# EAGLE design Escorna_CPU_2_01 (EAGLE 6.4)
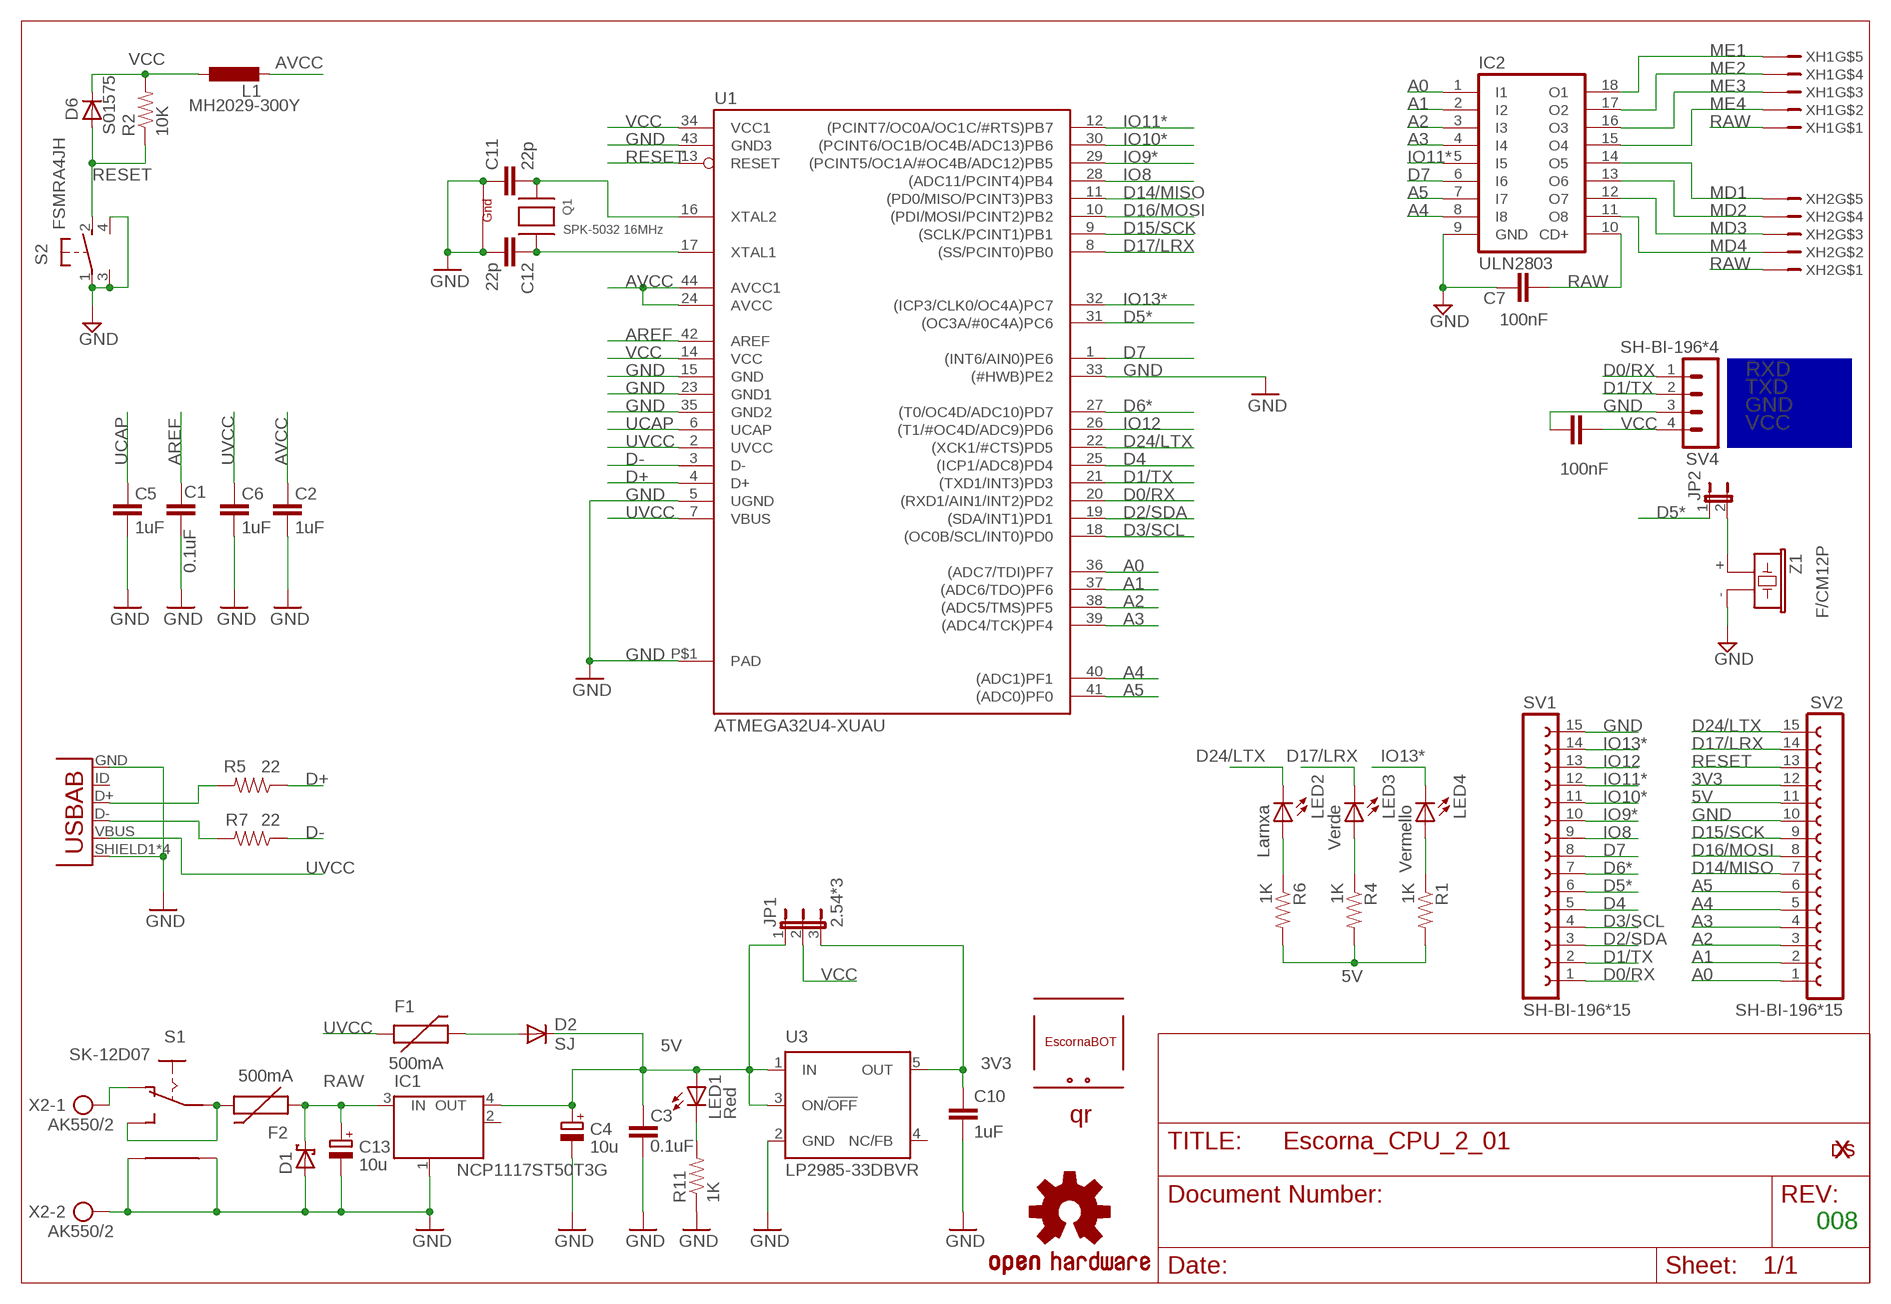
[diagram p0: schematic, sheet 1]

## Parts
C1  0.1uF  CAP0603-CAP  [0603-CAP]
C2  1uF  CAP0603-CAP  [0603-CAP]
C3  0.1uF  CAP0603-CAP  [0603-CAP]
C4  10u  CPOL-EUSMCB  [SMC_B]
C5  1uF  CAP0603-CAP  [0603-CAP]
C6  1uF  CAP0603-CAP  [0603-CAP]
C7  100nF  C-EUC0603K  [C0603K]
C8  100nF  C-EUC0603K  [C0603K]
C10  1uF  CAP0603-CAP  [0603-CAP]
C11  22p  C-EUC0603  [C0603-ROUND]
C12  22p  C-EUC0603  [C0603-ROUND]
C13  10u  CPOL-EUSMCB  [SMC_B]
D1  SCHOTTKY-DIODESMA  [SMA]
D2  SJ  DIODESOD  [SOD-323]
D6  S01575  DIODESOD  [SOD-323]
F1  500mA  PTCSMD  [PTC-1206]
F2  500mA  PTCSMD  [PTC-1206]
IC1  NCP1117ST50T3G  MC33269ST-3.3T3  [SOT223]
IC2  ULN2803  ULN2803A"  [DIL18]
JP1  2.54*3  JP2E  [JP2]
JP2  JP1E  [JP1]
L1  MH2029-300Y  L-EUL2012C  [L2012C]
LED1  Red  LED0603  [LED-0603]
LED2  Larnxa  LED0603  [LED-0603]
LED3  Verde  LED0603  [LED-0603]
LED4  Vermello  LED0603  [LED-0603]
LOGO1  OSHW-LOGOS  [OSHW-LOGO-S]
Q1  SPK-5032 16MHz  XTAL-4-3225  [NX3225]
R1  1K  RESISTOR0603-RES  [0603-RES]
R2  10K  RESISTOR0603-RES  [0603-RES]
R4  1K  RESISTOR0603-RES  [0603-RES]
R5  22  RESISTOR0603-RES  [0603-RES]
R6  1K  RESISTOR0603-RES  [0603-RES]
R7  22  RESISTOR0603-RES  [0603-RES]
R11  1K  RESISTOR0603-RES  [0603-RES]
S1  SK-12D07  SK12F14D  [SK-12D07]
S2  FSMRA4JH  31-XX  [B3F-31XX]
SV1  SH-BI-196*15  FE15-1  [FE15]
SV2  SH-BI-196*15  FE15-1  [FE15]
SV4  SH-BI-196*4  MA04-1  [MA04-1]
U1  ATMEGA32U4-XUAU  [TQFP44-PAD]
U2  MICRO USB  USB-AB  [USB-AB-MICRO-SMD]
U3  LP2985-33DBVR  LP2985-XXDBVR33  [SOT23-DBV]
U$2  XDESIG  [XDESIG_CU_2]
U$3  ESCORNABOT  [ESCORNA_PEQUE]
U$5  XDESIG21  [XDESIG]
U$6  QR25  [ESCORNA_QR25]
X2  AK550/2  [AK550/2]
XH1  XH2.54-5P  B5B-XH-A  [B5B-XH-A]
XH2  XH2.54-5P  B5B-XH-A  [B5B-XH-A]
Z1  F/CM12P  [F/CM12P]

## Nets
3V3: C10.1 JP1.3 SV2.12 U3.5(OUT)
5V: C3.2 C4.+ D2.1(C) IC1.4(OUT) JP1.1 LED1.A R1.2 R4.2 R6.2 SV2.11 U3.1(IN) U3.3(ON/!OFF)
A0: IC2.1(I1) SV2.1 U1.36((ADC7/TDI)PF7)
A1: IC2.2(I2) SV2.2 U1.37((ADC6/TDO)PF6)
A2: IC2.3(I3) SV2.3 U1.38((ADC5/TMS)PF5)
A3: IC2.4(I4) SV2.4 U1.39((ADC4/TCK)PF4)
A4: IC2.8(I8) SV2.5 U1.40((ADC1)PF1)
A5: IC2.7(I7) SV2.6 U1.41((ADC0)PF0)
AREF [aref]: C1.2 U1.42(AREF)
AVCC: C2.2 L1.2 U1.24(AVCC) U1.44(AVCC1)
D0/RX: SV1.1 SV4.1 U1.20((RXD1/AIN1/INT2)PD2)
D1/TX: SV1.2 SV4.2 U1.21((TXD1/INT3)PD3)
D2/SDA: SV1.3 U1.19((SDA/INT1)PD1)
D3/SCL: SV1.4 U1.18((OC0B/SCL/INT0)PD0)
D4: SV1.5 U1.25((ICP1/ADC8)PD4)
D5*: JP2.1 SV1.6 U1.31((OC3A/#0C4A)PC6)
D6*: SV1.7 U1.27((T0/OC4D/ADC10)PD7)
D7: IC2.6(I6) SV1.8 U1.1((INT6/AIN0)PE6)
D14/MISO: SV2.7 U1.11((PD0/MISO/PCINT3)PB3)
D15/SCK: SV2.9 U1.9((SCLK/PCINT1)PB1)
D16/MOSI: SV2.8 U1.10((PDI/MOSI/PCINT2)PB2)
D17/LRX: LED3.C SV2.14 U1.8((SS/PCINT0)PB0)
D24/LTX: LED2.C SV2.15 U1.22((XCK1/#CTS)PD5)
D+: R5.1 U1.4(D+)
D-: R7.1 U1.3(D-)
GND [power]: C1.1 C2.1 C3.1 C4.- C5.1 C6.1 C7.1 C8.1 C10.2 C11.1 C12.2 C13.- D1.A IC1.1(GND/ADJ) IC2.9(GND) Q1.2(G2) Q1.4(G1) R11.1 S1.P$4 S1.P$5 S2.1(P) S2.3(CH2) S2.4(CH1) SV1.15 SV2.10 SV4.3 U1.5(UGND) U1.15(GND) U1.23(GND1) U1.33((#HWB)PE2) U1.35(GND2) U1.43(GND3) U1.P$1(PAD) U2.GND U2.SHIELD1(SHIELD) U2.SHIELD2(SHIELD) U2.SHIELD3(SHIELD) U2.SHIELD4(SHIELD) U3.2(GND) X2.2 Z1.-
IO8: SV1.9 U1.28((ADC11/PCINT4)PB4)
IO9*: SV1.10 U1.29((PCINT5/OC1A/#OC4B/ADC12)PB5)
IO10*: SV1.11 U1.30((PCINT6/OC1B/OC4B/ADC13)PB6)
IO11*: IC2.5(I5) SV1.12 U1.12((PCINT7/OC0A/OC1C/#RTS)PB7)
IO12: SV1.13 U1.26((T1/#OC4D/ADC9)PD6)
IO13*: LED4.C SV1.14 U1.32((ICP3/CLK0/OC4A)PC7)
MD1: IC2.14(O5) XH2.P$5
MD2: IC2.13(O6) XH2.P$4
MD3: IC2.12(O7) XH2.P$3
MD4: IC2.11(O8) XH2.P$2
ME1: IC2.18(O1) XH1.P$5
ME2: IC2.17(O2) XH1.P$4
ME3: IC2.16(O3) XH1.P$3
ME4: IC2.15(O4) XH1.P$2
N$1: F2.2 S1.P$1(P) S1.P$3(S)
N$2: LED2.A R6.1
N$3: D2.2(A) F1.2
N$4: LED3.A R4.1
N$5: LED4.A R1.1
N$6: R7.2 U2.D-
N$7: S1.P$2(O) X2.1
N$8: R5.2 U2.D+
N$9: C12.1 Q1.3(X2) U1.17(XTAL1)
N$10: LED1.C R11.2
N$11: JP2.2 Z1.+
RAW: C7.2 C13.+ D1.C F2.1 IC1.3(IN) IC2.10(CD+) XH1.P$1 XH2.P$1
RESET: D6.2(A) R2.1 S2.2(S) SV2.13 U1.13(RESET)
UCAP: C5.2 U1.6(UCAP)
UVCC: C6.2 F1.1 U1.2(UVCC) U1.7(VBUS) U2.VBUS
VCC: C8.2 D6.1(C) JP1.2 L1.1 R2.2 SV4.4 U1.14(VCC) U1.34(VCC1)
XTAL3: C11.2 Q1.1(X1) U1.16(XTAL2)
Unconnected: IC1.2(OUT) U2.ID(USBID) U3.4(NC/FB)

## Notes on the sheet
- RXD
- TXD
- GND
- VCC
- 008

## Library data of the parts
C1-C3 C5 C6 C10 = SparkFun:CAP: Capacitor Standard 0603 ceramic capacitor, and 0.1" leaded capacitor.
C4 C13 = rcl:CPOL-EU: POLARIZED CAPACITOR, European symbol
C7 C8 = rcl:C-EU: CAPACITOR, European symbol
C11 C12 = SmartPrj:C-EU: CAPACITOR, European symbol
D1 = diode:SCHOTTKY-DIODE: Schottky Diode
D2 D6 = SparkFun:DIODE: Diode These are standard reverse protection diodes and small signal diodes. SMA package can handle up to about 1A. SOD-323 can handle about 200mA. What the SOD-323 package when ordering, there are some mfgs out there that are 5-pin packages.
F1 F2 = SparkFun:PTC: Resettable Fuse PTC Resettable Fuse. Spark Fun Electronics SKU : COM-08357
IC1 = linear:MC33269ST*: Adjustable Output Low Dropout Voltage Regulator 800 mA Source: http://www.onsemi.com/pub/Collateral/MC33269-D.PDF
IC2 = uln-udn:ULN2803A: DRIVER ARRAY
JP1 = jumper:JP2E: JUMPER
JP2 = jumper:JP1E: JUMPER
L1 = rcl:L-EU: INDUCTOR, European symbol
LED1-LED4 = SparkFun:LED: LEDs Standard schematic elements and footprints for 5mm, 3mm, 1206, and 0603 sized LEDs. 5mm - Spark Fun Electronics SKU : COM-00529 (and others)
LOGO1 = SparkFun-Aesthetics:OSHW-LOGO: Open Source Hardware Logo This logo indicates the piece of hardware it is found on incorporates a OSHW license and/or adheres to the definition of open source hardware found here: http://freedomdefined.org/OSHW
Q1 = adafruit:XTAL-4: Classic 4-pin 3.2 x 2.5mm crystal
R1 R2 R4-R7 R11 = SparkFun:RESISTOR: Resistor Basic schematic elements and footprints for 0603, 1206, and PTH resistors.
S1 = escorna:SK12F14
S2 = switch-omron:31-XX: OMRON SWITCH; MPN: B3F-3100; OC_FARNELL: 959704; OC_NEWARK: 36M3582
SV1 SV2 = con-lsta:FE15-1: FEMALE HEADER; OC_FARNELL: unknown; OC_NEWARK: unknown
SV4 = con-lstb:MA04-1: PIN HEADER; OC_FARNELL: unknown; OC_NEWARK: unknown
U1 = SmartPrj:ATMEGA32U4-XU
U2 = SparkFun-Connectors:USB-AB: This is a USB AB connector that is compatible with USB OTG. i.e. this connector can serve as a host or device
U3 = SmartPrj:LP2985-XXDBVR: ULTRALOW-POWER 50-mA LOW-DROPOUT LINEAR REGULATORS 50-mA Low-Dropout Regulator Source: http://focus.ti.com/lit/ds/symlink/tps77001.pdf
U$2 U$5 = xdesig:XDESIG
U$3 = escorna:ESCORNABOT
U$6 = escorna:QR
X2 = con-ptr500:AK550/2: CONNECTOR; OC_FARNELL: unknown; OC_NEWARK: unknown
XH1 XH2 = con-jst:B5B-XH-A
Z1 = buzzer:F/CM12P: BUZZER Source: Buerklin; OC_FARNELL: unknown; OC_NEWARK: unknown

## Net classes
0 default: width 0.254 mm, drill 0.61 mm, clearance 0.254 mm
1 power: width 0.254 mm, drill 0.61 mm, clearance 0.254 mm
2 gnd: width 0.254 mm, drill 0.61 mm, clearance 0.254 mm
3 usbvcc: width 0.254 mm, drill 0.61 mm, clearance 0.254 mm
4 aref: width 0.254 mm, drill 0.61 mm, clearance 0.254 mm

## Board
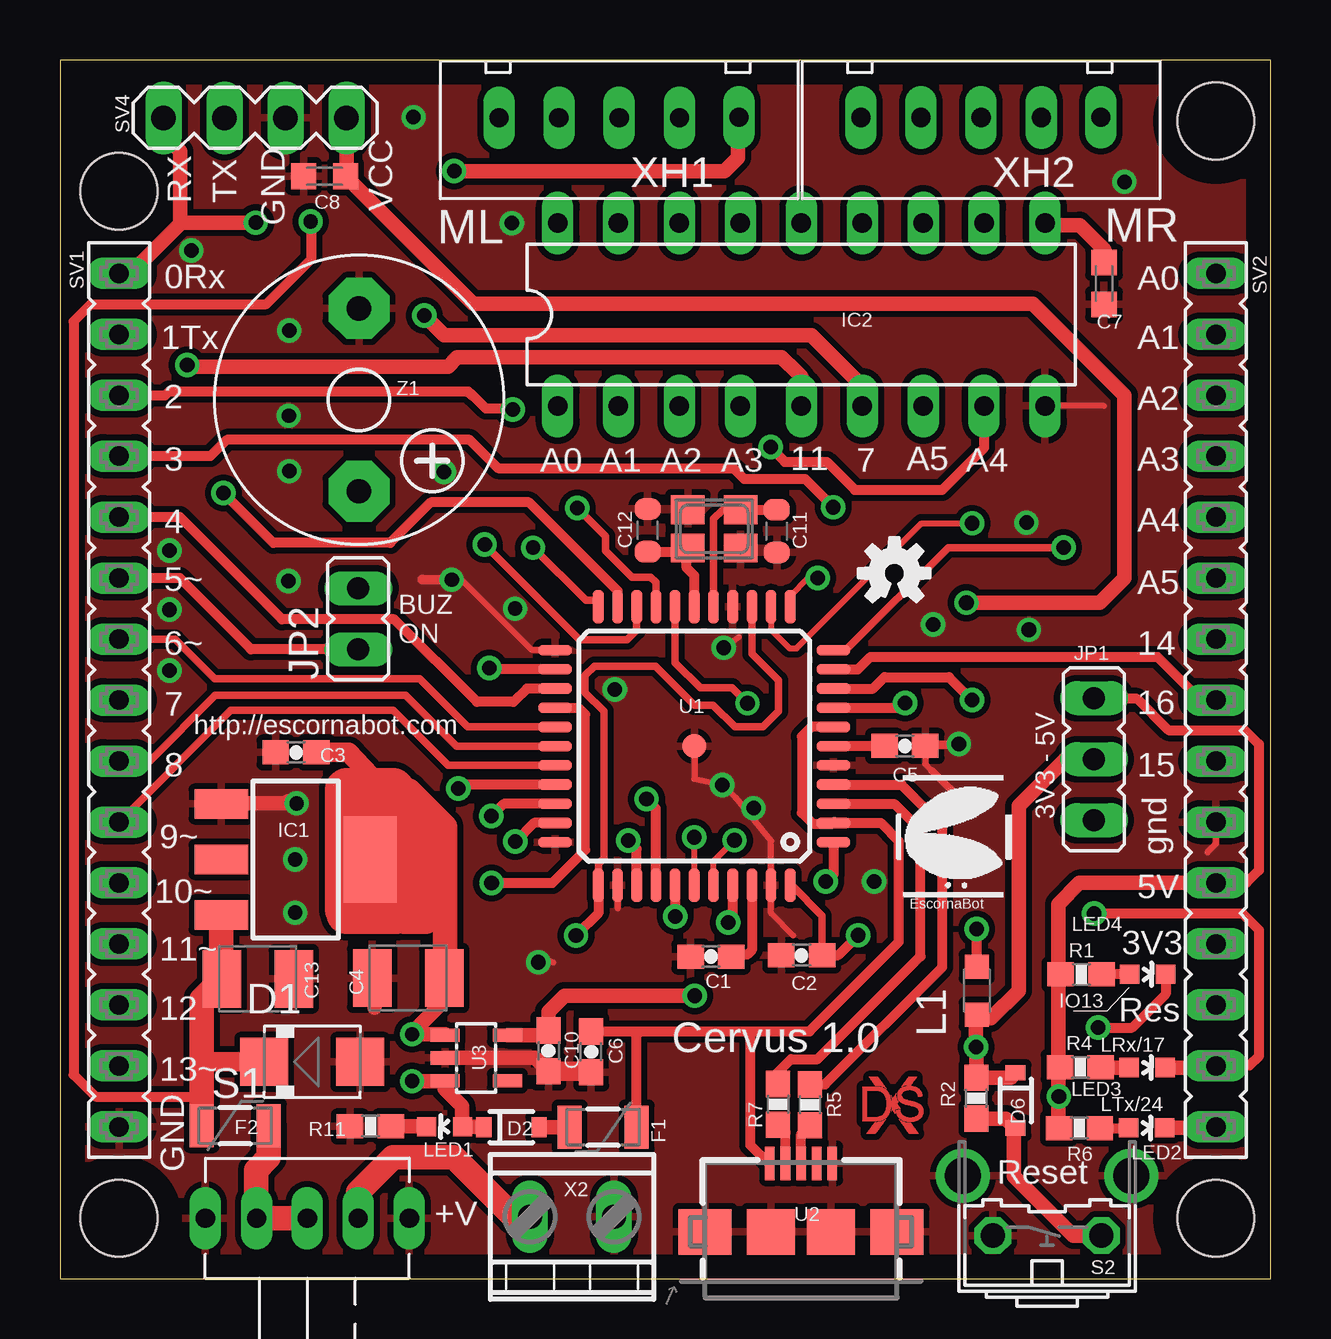
[diagram p1: board, top side]
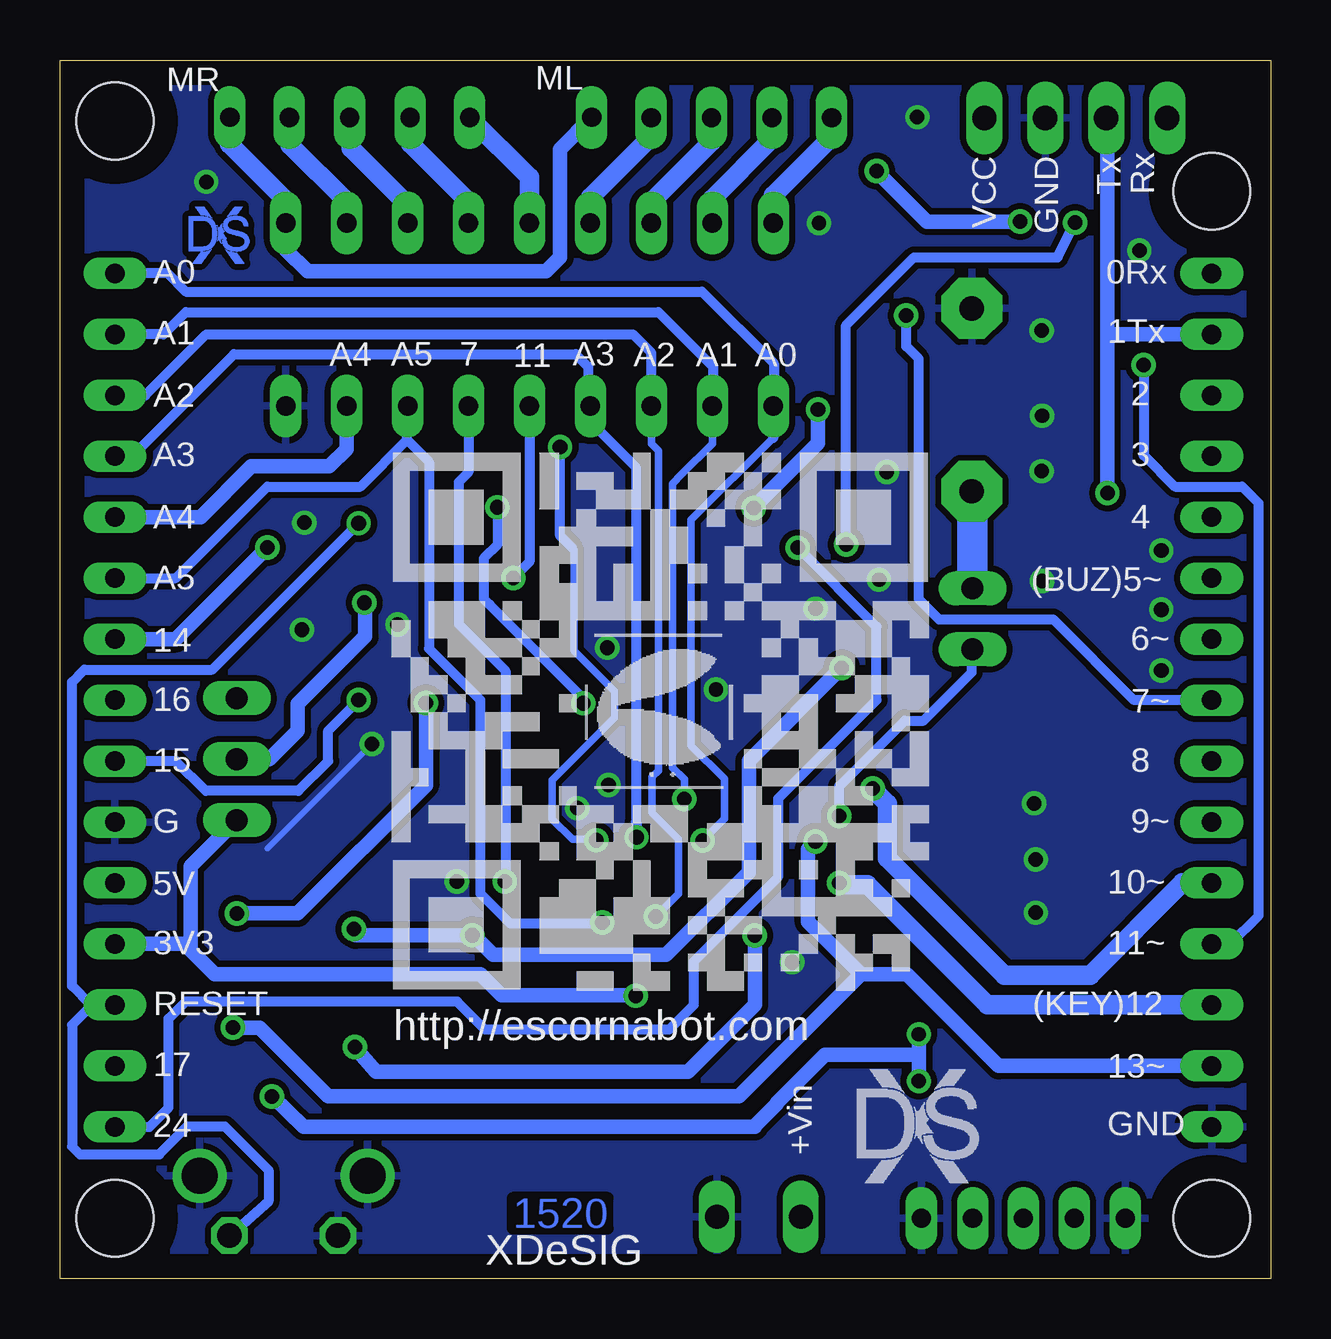
[diagram p2: board, bottom side, seen from below]

Size 50.47 x 50.79 mm. Coordinates in mm from the lower left corner, seen from the top.
Outline: 50.47,50.79 0,50.79 0,0 50.47,0 50.47,50.79
Copper layers (1*16): Top 0.035mm / dielectric 1.5mm / Bottom 0.035mm
Design rules "default": minimum track width 10mil, minimum drill 24mil, track to track 8mil, track to pad 8mil, pad to pad 8mil, via to via 8mil, smd to smd 8mil, copper to edge 40mil, drill to drill 8mil, minimum pad ring 10mil, minimum via ring 8mil, stop-mask expansion 4mil, vias tented up to drill 0mil, thermal gap 10mil
Holes 3.2 mm at 2.46,45.33 48.18,48.25 2.46,2.53 48.18,2.53

### Footprints (pad centres in the part's own frame; a part is rotated, then mirrored left to right if it is on the bottom)
0603-CAP = smd 1.1 x 1: 1 -0.85,0; 2 0.85,0
SMC_B = smd 1.6 x 2.4: + -1.5,0; - 1.5,0
C0603K = smd 1.05 x 1.08: 1 -0.875,0; 2 0.875,0
C0603-ROUND = smd 0.898 x 1.1: 1 -0.889,0; 2 0.889,0
SMA = smd 2 x 2: A 2,0; C -2,0
SOD-323 = smd 0.63 x 0.83: 1 -1.15,0; 2 1.15,0
PTC-1206 = smd 1 x 1.8: 1 -1.4,0; 2 1.4,0
SOT223 = smd 1.219 x 2.235: 1 -2.311,-3.099; 2 0,-3.099; 3 2.311,-3.099 | smd 3.6 x 2.2: 4 0,3.099
DIL18 = drill 0.813 long: 1 -10.16,-3.81; 2 -7.62,-3.81; 3 -5.08,-3.81; 4 -2.54,-3.81; 5 0,-3.81; 6 2.54,-3.81; 7 5.08,-3.81; 8 7.62,-3.81; 9 10.16,-3.81; 10 10.16,3.81; 11 7.62,3.81; 12 5.08,3.81; 13 2.54,3.81; 14 0,3.81; 15 -2.54,3.81; 16 -5.08,3.81; 17 -7.62,3.81; 18 -10.16,3.81
JP2 = drill 0.914 long: 1 -2.54,0; 2 0,0; 3 2.54,0
JP1 = drill 0.914 long: 1 0,-1.27; 2 0,1.27
L2012C = smd 1 x 1: 1 -1,0; 2 1,0
LED-0603 = smd 0.8 x 0.8: A 0,-0.75; C 0,0.75
NX3225 = smd 1.4 x 1.2: 1 -1.1,-0.8; 2 1.1,-0.8; 3 1.1,0.8; 4 -1.1,0.8
0603-RES = smd 1.1 x 1: 1 -0.85,0; 2 0.85,0
SK-12D07 = drill 0.8 long: P$1 0,0; P$2 2.115,0; P$3 -2.115,0; P$4 -4.25,0; P$5 4.25,0
B3F-31XX = drill 1.016 octagon: 1 -2.261,-1.245; 2 2.261,-1.245 | drill 1.499 pad 2.159: 3 -3.505,1.245; 4 3.505,1.245
FE15 = drill 0.813 long: 1 -17.78,0; 2 -15.24,0; 3 -12.7,0; 4 -10.16,0; 5 -7.62,0; 6 -5.08,0; 7 -2.54,0; 8 0,0; 9 2.54,0; 10 5.08,0; 11 7.62,0; 12 10.16,0; 13 12.7,0; 14 15.24,0; 15 17.78,0
MA04-1 = drill 1.016 long: 1 -3.81,0; 2 -1.27,0; 3 1.27,0; 4 3.81,0
TQFP44-PAD = smd 1.4 x 0.45: 1 -5.8,4; 2 -5.8,3.2; 3 -5.8,2.4; 4 -5.8,1.6; 5 -5.8,0.8; 6 -5.8,0; 7 -5.8,-0.8; 8 -5.8,-1.6; 9 -5.8,-2.4; 10 -5.8,-3.2; 11 -5.8,-4; 23 5.8,-4; 24 5.8,-3.2; 25 5.8,-2.4; 26 5.8,-1.6; 27 5.8,-0.8; 28 5.8,0; 29 5.8,0.8; 30 5.8,1.6; 31 5.8,2.4; 32 5.8,3.2; 33 5.8,4 | smd 0.45 x 1.4: 12 -4,-5.8; 13 -3.2,-5.8; 14 -2.4,-5.8; 15 -1.6,-5.8; 16 -0.8,-5.8; 17 0,-5.8; 18 0.8,-5.8; 19 1.6,-5.8; 20 2.4,-5.8; 21 3.2,-5.8; 22 4,-5.8; 34 4,5.8; 35 3.2,5.8; 36 2.4,5.8; 37 1.6,5.8; 38 0.8,5.8; 39 0,5.8; 40 -0.8,5.8; 41 -1.6,5.8; 42 -2.4,5.8; 43 -3.2,5.8; 44 -4,5.8 | smd 1 x 1: P$1 0,0
USB-AB-MICRO-SMD = smd 1.4 x 0.4: D+ 2.85,0; D- 2.85,0.65; GND 2.85,-1.3; ID 2.85,-0.65; VBUS 2.85,1.3 | smd 1.9 x 2.2: SHIELD1 0,4; SHIELD4 0,-4 | smd 1.9 x 2: SHIELD2 0,1.25; SHIELD3 0,-1.25
SOT23-DBV = smd 0.55 x 1.2: 1 -0.95,-1.3; 2 0,-1.3; 3 0.95,-1.3; 4 0.95,1.3; 5 -0.95,1.3
AK550/2 = drill 1 pad 1.5 long: 1 -1.75,0; 2 1.75,0
B5B-XH-A = drill 0.8 long: P$1 -5.17,-0.19; P$2 -2.69,-0.175; P$3 -0.175,-0.175; P$4 2.34,-0.175; P$5 4.83,-0.175
F/CM12P = drill 1.016 pad 2.54 octagon: + 3.81,0; - -3.81,0

### Placement (x,y rotation side)
C1  27.14,13.44 0 top
C2  30.92,13.48 0 top
C3  9.84,21.94 0 top
C4  14.52,12.54 180 top
C5  35.22,22.21 180 top
C6  22.14,9.46 90 top
C7  43.52,41.48 90 top
C8  11.03,45.95 0 top
C10  20.36,9.51 270 top
C11  29.88,31.16 90 top
C12  24.5,31.19 90 top
C13  8.24,12.51 0 top
D1  10.52,9.04 0 top
D2  18.82,6.33 0 top
D6  39.83,7.44 270 top
F1  22.64,6.33 180 top
F2  7.3,6.39 0 top
IC1  9.82,17.48 270 top
IC2  30.9,40.19 0 top
JP1  43.1,21.66 270 top
JP2  12.44,27.5 0 top
L1  38.22,12.01 90 top
LED1  16.04,6.35 90 top
LED2  45.29,6.29 270 top
LED3  45.32,8.81 270 top
LED4  45.34,12.7 270 top
LOGO1  34.78,29.4 0 top
Q1  27.27,31.25 180 top
R1  42.57,12.69 180 top
R2  38.2,7.54 90 top
R4  42.53,8.83 180 top
R5  31.26,7.25 270 top
R6  42.5,6.29 180 top
R7  29.93,7.28 270 top
R11  12.94,6.36 0 top
S1  10.31,2.53 0 top
S2  41.15,3.05 0 top
SV1  2.46,24.12 270 top
SV2  48.18,24.12 270 top
SV4  8.13,48.38 0 top
U1  26.44,22.2 180 top
U2  30.89,1.97 90 top
U3  17.35,9.21 270 top
U$1  XDESIG  [XDESIG_CU_2]  33.46,6.06 0 top
U$2  45.11,42.32 0 bottom
U$3  34.78,15.84 0 top
U$5  17.24,4 0 bottom
U$6  25.71,23.96 0 bottom
X2  21.34,2.6 0 top
XH1  23.14,48.21 180 top
XH2  38.22,48.22 180 top
Z1  12.46,36.63 270 top

### Tracks (layer width: path | path; a pad name or v marks a point on that pad's centre or on a via)
3V3  (via drill 0.61 pad 0.86)
  Top 0.254: C10.1 20.36,10.4
  Top 0.406: 20.36,10.4 20.36,10.68
  Top 0.61: U3.5 20.17,10.16 C10.1 | 20.36,10.68 20.36,11.13 21.03,11.8 v26.46,11.8
  Bottom 0.406: 26.48,11.82 v26.46,11.8
  Bottom 0.61: 26.48,11.82 32.07,11.82 32.94,12.69 44.02,12.69 45.03,13.71 45.03,13.96 | JP1.3 45.03,17.19 45.03,13.96 | SV2.12 45.03,13.96
5V  (via drill 0.6, 0.61 pad 0.86)
  Top 0.254: U3.3 16.05,8.31 16.04,8.25 | 14.79,10.2 v14.68,10.2 | 16.05,10.2 U3.1 | 43.14,24.17 43.14,24.18 JP1.1
  Top 0.305: 12.92,20.98 13.29,20.98 13.96,20.31
  Top 0.406: SV2.11 49.45,16.5 49.97,17.02 49.97,22.29 49.39,22.87 46.2,22.87 44.9,24.17 43.14,24.17 43.13,24.17
  Top 0.61: R6.2 41.62,6.32 41.62,7.65 | 41.62,7.65 v41.64,7.61 | 41.62,12.59 R1.2 41.62,12.79 | 41.62,8.76 41.62,12.79 | SV2.11 42.5,16.5 41.62,15.62 41.62,12.79 | 41.62,7.65 41.62,8.76 | 41.62,8.76 R4.2 | 16.05,12.51 16.05,11.63 14.61,10.2 | 16.05,10.2 14.79,10.2 14.61,10.2 | 14.61,10.2 | 14.71,10.16 v14.68,10.2 | v14.68,8.25 16.04,8.25 16.04,7.92 16.76,7.21 16.76,6.38 LED1.A 17.65,6.35 D2.1
  Top 0.813: C3.2 12.03,21.94 12.92,20.98 | IC1.4 | 16.05,12.51 16.05,12.7 C4.+
  Top 1.016: 16.05,12.7 16.05,18.83 14.54,20.33 14.54,19.29 15.2,18.64 15.2,14.94 15.26,14.88 14.35,14.88 14.03,15.2
  Top 1.676: IC1.4 12.92,15.39 12.98,15.33 11.95,15.33 11.88,15.39 11.88,20.4 11.95,20.46 13.89,20.46 13.96,20.4 13.96,20.31 13.96,15.27 14.03,15.2 11.95,15.2 11.95,18.36 12.62,19.04
  Bottom 0.254: 21.47,6.42 21.51,6.34
  Bottom 0.61: 41.56,7.61 v41.64,7.61 40.3,6.34 21.51,6.34 | 21.47,6.42 20.58,7.3 20.58,7.34 18.58,9.35 14.87,9.35 14.68,9.15 | v14.68,10.2 14.68,9.15 | 14.68,9.15 v14.68,8.25
A0  (via drill 0.61 pad 0.86)
  Top 0.406: U1.36 24.04,17.91 v23.68,18.27
  Bottom 0.305: 20.74,35.05 24.17,31.62 24.17,22.22 22.78,20.83 22.78,19.17 v23.68,18.27
  Bottom 0.406: SV2.1 45.99,41.9 45.23,41.14 23.71,41.14 20.72,38.15 20.72,36.4 IC2.1 20.74,35.05
A1  (via drill 0.61 pad 0.86)
  Top 0.406: U1.37 24.84,19.6 v24.45,19.99
  Bottom 0.254: 24.56,33.52 24.73,33.35
  Bottom 0.305: v24.45,19.99 24.45,20.81 24.95,21.31 24.95,33.14 24.56,33.52 23.28,34.8 IC2.2
  Bottom 0.406: IC2.2 23.26,36.4 23.26,38.02 25.53,40.29 45.23,40.29 46.16,39.36 SV2.2
A2  (via drill 0.61 pad 0.86)
  Top 0.406: U1.38 v25.64,15.1
  Bottom 0.305: v25.64,15.1 25.63,15.1 24.69,16.04 24.69,18.32 25.79,19.42 25.79,20.92 25.53,21.18 25.53,34.51 25.82,34.8 IC2.3
  Bottom 0.406: SV2.3 46.91,36.82 44.37,39.36 26.59,39.36 25.82,38.59 IC2.3 25.79,36.34
A3  (via drill 0.61 pad 0.86)
  Top 0.254: U1.39 v26.44,18.4
  Bottom 0.254: 26.46,19.04 26.44,19.01
  Bottom 0.406: SV2.4 47.47,34.28 43.21,38.54 28.98,38.54 28.46,38.02 28.46,36.47 IC2.4 28.36,35.72 26.46,33.82 26.46,19.04 | 26.44,19.01 v26.44,18.4
A4  (via drill 0.61 pad 0.86)
  Top 0.254: U1.40 27.24,17.4 v28.11,18.28
  Top 0.406: v29.63,34.67 29.63,34.63 30.21,34.05 31.97,34.05 33.14,32.88 36.77,32.88 38.53,34.64 IC2.8
  Bottom 0.305: 29.13,30.47 29.04,30.38 29.04,26.18 27.35,24.49 27.35,23.39 29.95,20.79 29.95,19.16 29.11,18.32 28.16,18.32 v28.11,18.28
  Bottom 0.406: 29.13,30.47 29.63,30.97 v29.63,34.67
  Bottom 0.61: SV2.5 44.61,31.74 42.5,33.86 39.25,33.86 38.53,34.57 IC2.8
A5  (via drill 0.61 pad 0.86)
  Top 0.406: U1.41 28.04,15.03 v27.86,14.85
  Bottom 0.406: SV2.6 45.64,29.2 41.83,33.01 37.95,33.01 36,34.96 | v27.86,14.85 27.9,14.81 31.69,14.81 32.94,16.06 32.94,24.12 35.09,26.26 35.09,34.05 36,34.96 | 36,34.96 36,36.36 IC2.7
AREF
  Top 0.406: U1.42 28.84,13.7 28.65,13.51 28.06,13.51 C1.2
AVCC  (via drill 0.61 pad 0.86)
  Top 0.254: 17.89,25.2 v17.89,25.46
  Top 0.305: U1.44 30.51,16.4 31.77,15.13 C2.2
  Top 0.406: C2.2 32.45,13.49 v33.28,14.32 | U1.24 17.95,25.4 v17.89,25.46 | 38.19,14.36 v38.22,14.58 L1.2
  Bottom 0.61: v38.22,14.58 38.15,14.32 v33.28,14.32 33.23,14.32 32.42,13.51 25.21,13.51 21.76,16.95 21.76,21.59 v17.89,25.46
D0/RX  (via drill 0.6)
  Top 0.305: U1.20 24.04,27.04 23.65,26.64 21.66,26.64 v17.7,30.6
  Top 0.406: v8.16,44.02 7.96,44.02
  Top 0.61: SV4.1 4.32,47.66 5,46.98 5,44 5.02,44.02 5.05,44.02 | 7.96,44.02 5.05,44.02 | SV1.1 2.94,41.9 5.05,44.02
  Bottom 0.406: v17.7,30.6 17.7,39.73 14.87,42.57 8.89,42.57 v8.16,44.02
D1/TX  (via drill 0.6)
  Top 0.406: v6.81,32.75 8.89,30.67 13.77,30.67 15.46,32.36 19.55,32.36 23.24,28.67 U1.21
  Bottom 0.61: v6.81,32.75 6.81,39.36 | 6.81,39.36 6.81,48.33 SV4.2 | SV1.2 6.81,39.36
D2/SDA  (via drill 0.61 pad 0.86)
  Top 0.305: U1.19 24.84,29.02 24.62,29.24 23.84,29.24 22.74,30.34 22.74,30.95 v21.56,32.13
  Top 0.406: v18.88,36.23 18.85,36.26 17.76,36.26 17.2,36.82 17.17,36.82 17.02,36.98 4.54,36.98 4.38,36.82 SV1.3
  Bottom 0.406: v18.88,36.23 18.88,35.63 | v21.56,32.13 21.56,32.28
  Bottom 0.61: v18.88,36.23 18.88,34.81 v21.56,32.13
D3/SCL  (via drill 0.61 pad 0.86)
  Top 0.305: U1.18 25.64,25.68 26.7,24.62 28.02,24.62 v28.66,23.99
  Top 0.406: v32.23,32.16 31.06,33.34 28.52,33.34 28.07,33.79 18.25,33.79 17.08,34.96 6.95,34.96 6.27,34.28 SV1.4
  Bottom 0.406: v32.23,32.16 32.23,30.6 32.81,30.02 32.81,28.35 32.56,28.1 | 32.56,28.1 32.58,28.1 | v28.66,23.99 28.66,24.2 32.56,28.1
D4
  Top 0.406: U1.25 19.46,24.6 18.9,24.04 17.38,24.04 13.93,27.48 9.26,27.48 5,31.74 SV1.5
D5*  (via drill 0.61 pad 0.86)
  Top 0.406: U1.31 18.49,19.8 v17.98,19.29 | SV1.6 5,29.2 7.96,26.23 JP2.1
  Bottom 0.406: v17.98,19.29 17.98,20.54 15.26,23.26 14.48,23.26 12.46,25.27 12.46,26.2 JP2.1
D6*
  Top 0.305: U1.27 17,23 14.98,25.01 6.44,25.01 4.79,26.66 SV1.7
D7  (via drill 0.61 pad 0.86)
  Top 0.406: U1.1 32.24,16.87 v31.92,16.55
  Top 0.61: IC2.6 33.44,37.19 31.32,39.32 16.02,39.32 v15.2,40.14
  Bottom 0.406: v31.92,16.55 31.9,16.58 31.9,25.34 33.85,27.29 33.85,33.21 33.44,33.62 IC2.6 | SV1.8 5.71,24.12 9.07,27.48 13.83,27.48 14.68,28.33 14.68,38.34 15.2,38.86 v15.2,40.14
D14/MISO  (via drill 0.61 pad 0.86)
  Top 0.305: v41.83,30.47 37.03,30.47 32.81,26.25 32.29,26.25 U1.11
  Bottom 0.61: SV2.7 45.64,26.66 v41.83,30.47
D15/SCK  (via drill 0.61 pad 0.86)
  Top 0.406: U1.9 33.89,24.6 34.37,25.08 37.06,25.08 v38.02,24.12
  Bottom 0.406: 48.09,21.58 SV2.9 45.64,21.58 44.4,20.33 40.54,20.33 39.29,21.58 39.29,22.85 v38.02,24.12
D16/MOSI
  Top 0.406: SV2.8 47.55,24.12 45.75,25.92 33.79,25.92 33.26,25.4 U1.10
D17/LRX  (via drill 0.61 pad 0.86)
  Top 0.406: U1.8 35.03,23.8 v35.23,23.99 | v43.1,15.23 49.29,15.23 49.97,14.55 49.97,9.29 49.58,8.89 48.2,8.89 SV2.14
  Top 0.61: SV2.14 48.11,8.81 LED3.C
  Bottom 0.406: 35.22,23.98 v35.23,23.99
  Bottom 0.61: v43.1,15.23 40.56,15.23 35.22,20.57 35.22,23.98
D24/LTX  (via drill 0.6)
  Top 0.305: U1.22 22.44,28.27 21.92,28.27 v19.72,30.47
  Top 0.61: 46.09,6.35 LED2.C 48.14,6.29 SV2.15
  Bottom 0.406: SV2.15 46.74,6.34 45.94,7.14 45.94,10.85 45.23,11.56 33.91,11.56 32.75,10.39 25.08,10.39 24.05,11.42 24.05,13.23 20.53,16.76 20.53,20.02 16.43,24.12 16.43,27.18 v19.72,30.47 19.68,30.43
D+
  Top 0.406: U1.4 35.08,20.6 36.77,18.9 36.77,12.99 31.89,8.11 R5.1
D-
  Top 0.406: U1.3 34.78,19.8 35.87,18.71 35.87,13.45 31.58,9.15 30.47,9.15 29.93,8.61 R7.1
GND  (via drill 0.6, 0.61 pad 0.86)
  Top 0.254: 30.56,14.31 29.64,15.23 U1.43 29.64,18.25 28.15,20.06 v27.61,20.58 26.44,20.84 U1.P$1 | 36.08,22.29 C5.1 | C5.1 36.21,22.29 v37.47,22.29 37.39,22.21 C5.1 | C5.1 36.07,21.46 36.35,21.18 36.7,20.83 | U1.23 19.69,26.2 16.69,29.2 16.63,29.15 | 43.52,36.38 IC2.9 | U1.35 23.24,15.45 | 19.83,13.58 20.55,13.2 v19.95,13.2 | SV2.10 48.18,18.13 47.82,17.77 | 28.3,26.74 v27.67,26.3
  Top 0.305: 37.75,19.78 36.35,21.18 | 16.63,29.15 15.21,29.15 v16.33,29.13
  Top 0.406: 15.11,29.15 v16.33,29.13
  Top 0.61: SV1.15 | 13.12,11.3 13.12,12.61 | IC1.1 6.75,19.81 9.6,19.81 9.51,19.9 9.64,19.84 | U3.2 19.81,9.21 C10.2
  Top 0.813: C10.2 22.1,8.65 C6.1
  Bottom 0.254: v37.47,22.29 41.83,17.93 | 29.03,19.65 v28.91,19.62
  other vias: 9.53,29.08 36.4,27.26 40.29,31.51 23.12,24.56 9.8,17.47 9.8,15.27 9.87,19.81 18.97,27.93 9.55,33.66 9.55,39.52 40.39,27.05 14.73,48.41 18.84,44 44.37,45.71 16.01,33.62 5.47,42.86 9.54,35.97 33.94,16.56 4.56,30.36 4.56,27.89 4.56,25.35
  pour Top: -0.08,50.79 50.72,50.79 50.72,-0.01 -0.08,-0.01
  pour Bottom: -0.08,50.79 50.72,50.79 50.72,-0.01 -0.08,-0.01
IO8
  Top 0.305: U1.28 16.53,22.2 14.41,24.31 6.46,24.31 3.73,21.58 SV1.9
IO9*
  Top 0.305: U1.29 16.19,21.4 13.89,23.69 7.11,23.69 SV1.10
IO10*  (via drill 0.61 pad 0.86)
  Top 0.406: U1.30 16.77,20.6 v16.6,20.43
  Bottom 0.406: 16.43,20.31 16.48,20.31 v16.6,20.43
  Bottom 0.813: SV1.11 3.69,16.5 7.53,12.67 11.1,12.67 15.97,17.54 15.97,19.81 v16.6,20.43
IO11*  (via drill 0.61, 0.61 pad 0.86)
  Top 0.254: U1.12 30.44,28.47 31.17,29.2 v31.58,29.2
  Top 0.61: IC2.5 30.9,37.59 30.4,38.09 30.08,38.41 16.56,38.41 16.17,38.02 5.36,38.02 v5.3,38.07
  Bottom 0.406: IC2.5 30.9,29.88 v31.58,29.2 | SV1.12 1.68,13.96 0.51,15.13 0.51,32.33 1.19,33.01 4,33.01 5.3,34.32 v5.3,38.07
IO12  (via drill 0.61 pad 0.86)
  Top 0.406: v17.99,16.5 20.53,16.5 21.89,17.86 21.89,23.52 21.61,23.8 U1.26
  Bottom 0.813: SV1.13 11.8,11.42 16.82,16.43 17.93,16.43 v17.99,16.5
IO13*  (via drill 0.61 pad 0.86)
  Top 0.406: U1.32 19.76,19 v18.98,18.22 | v43.27,10.47 44.7,10.47 46.09,11.87 LED4.C
  Bottom 0.61: SV1.14 11.35,8.88 15.16,12.69 17.08,12.69 | 17.08,12.69 22.16,7.61 39.29,7.61 42.16,10.47 v43.27,10.47 | 17.08,12.69 18.98,14.59 19.01,14.59 19.29,14.88 19.29,17.91 v18.98,18.22
MD1
  Bottom 0.813: IC2.14 30.9,45.9 XH2.P$5
MD2
  Bottom 0.813: IC2.13 33.44,44.89 35.87,47.31 35.87,48.38 XH2.P$4
MD3
  Bottom 0.813: IC2.12 35.98,44.76 38.34,47.12 38.34,48.33 XH2.P$3
MD4
  Bottom 0.813: IC2.11 38.52,44.9 40.87,47.25 40.87,48.35 XH2.P$2
ME1
  Bottom 0.813: IC2.18 20.74,45.15 18.32,47.57 18.32,48.38 XH1.P$5
ME2
  Bottom 0.813: IC2.17 23.28,45.01 20.79,47.51 20.79,48.38 XH1.P$4
ME3
  Bottom 0.813: IC2.16 25.82,44.88 23.32,47.38 XH1.P$3
ME4
  Bottom 0.813: IC2.15 28.36,45.07 25.86,47.57 25.86,48.36 XH1.P$2
N$1
  Top 1.016: 8.7,6.39 F2.2 8.71,5.07 8.18,4.54 8.18,2.55 S1.P$3 S1.P$1
N$2
  Top 0.406: R6.1 LED2.A
  Top 0.61: R6.1
N$3
  Top 0.61: D2.2 F1.2
N$4
  Top 0.61: LED3.A 43.33,8.81 R4.1
N$5
  Top 0.406: LED4.A R1.1
N$6
  Top 0.406: U2.D- 30.24,6.11 R7.2
N$7
  Top 1.016: X2.1 18.91,2.6 16.43,5.07 13.89,5.07 12.43,3.61 S1.P$2
N$8
  Top 0.406: U2.D+ 30.89,6.04 R5.2
N$9
  Top 0.406: C12.1 25.96,30.31 Q1.3 26.12,30.44 26.12,29.63 26.44,29.3 U1.17
N$10
  Top 0.61: R11.2 LED1.C
N$11
  Bottom 1.27: JP2.2 12.44,32.79 Z1.+
RAW  (via drill 0.6)
  Top 0.254: 41.06,43.91 IC2.10
  Top 0.406: C7.2 43.52,42.88 43.54,42.89 | 5.91,7.61 5.89,7.6 1.48,7.6 0.57,8.51 0.57,39.9 1.28,40.62 8.6,40.62 10.48,42.5 10.48,44.02 v10.45,44.06 | 28.33,48.38 XH1.P$1
  Top 0.61: 41.06,43.91 42.51,43.91 43.54,42.89 | v16.43,46.16 27.7,46.16 28.26,46.73 28.26,48.36 XH1.P$1
  Top 0.813: 6.79,12.64 6.73,12.71 | D1.C 6.09,9.04 6.09,9.06
  Top 1.016: IC1.3 6.73,12.71 6.73,12.52 C13.+ 5.91,11.67 5.91,8.88 | F2.1 5.91,7.61 5.91,8.88 | 6.09,9.06 5.91,8.88
  Bottom 0.61: 28.33,48.38 XH1.P$1 29.62,47.08 29.62,42.57 30.21,41.98 40.16,41.98 41.06,42.89 IC2.10 | v10.45,44.06 14.32,44.06 v16.43,46.16
  Bottom 0.813: 43.41,48.39 43.41,47.29 41.06,44.94 IC2.10
  Bottom 1.016: XH2.P$1 43.41,48.39
RESET  (via drill 0.61 pad 0.86)
  Top 0.254: U1.13 29.64,27.05 30.41,26.28 30.71,26.28 35.91,31.49 v38.02,31.49
  Top 0.61: R2.1 39.44,6.69 D6.2 39.77,6.23 39.77,4.28 42.24,1.8 S2.2
  Bottom 0.406: v38.02,31.49 44.12,25.39 49.45,25.39 49.97,24.87 49.97,12.21 49.18,11.42 SV2.13 49.14,11.42 49.97,10.59 49.97,5.52 49.65,5.19 46.33,5.19 45.16,6.36 43.6,6.36 41.78,4.54 41.78,3.24 S2.2
UCAP
  Top 0.406: C5.2 34.36,22.2 U1.6
UVCC
  Top 0.406: U1.2 32.27,19.04 32.29,19.04 | U1.7 31.32,23 30.93,22.61 30.93,19.42 31.38,18.97 32.21,18.97 U1.2 | 24.04,10.14 F1.1 24.07,6.29 | 24.04,10.14 24.05,10.15 | C6.2 24.05,10.31 | 24.05,10.31 28.72,10.31 | 28.72,10.31 31.24,10.31 34.95,14.03 34.95,18.25 34.21,19 U1.2 | U2.VBUS 29.55,4.82 28.78,5.58 28.78,10.25 28.72,10.31 | 24.04,10.14 24.04,10.3 24.05,10.31
VCC  (via drill 0.61 pad 0.86)
  Top 0.305: U1.14 28.85,26.05 29.95,24.95 29.95,23.65 29.3,23 28.13,23 27.22,23.91 26.44,23.91 24.82,25.54 22.28,25.54 21.89,25.14 21.89,24.43 22.67,23.65 22.67,17.54 22.44,17.31 U1.34
  Top 0.406: U1.34 22.44,15.25 v21.51,14.31 | 11.95,45.91 C8.2 | L1.1 38.18,11.01 38.18,10.79
  Top 0.61: D6.1 39.62,8.38 R2.2 38.2,9.55 v38.18,9.66 38.18,10.79 38.8,10.86 39.96,12.02 39.96,19.71 41.91,21.66 JP1.2 | v37.78,28.17 43.34,28.17 44.37,29.2 44.37,36.82 40.56,40.63 17.22,40.63 C8.2 11.94,45.99 SV4.4
  Bottom 0.406: 21.5,12.68 v21.51,14.31 | 23.34,9.6 21.51,11.42
  Bottom 0.61: v21.51,14.31 21.51,11.42 24.3,8.63 37.29,8.63 v38.18,9.66 | v37.78,28.17 37.75,28.14 37.75,26.77 40.56,23.96 40.56,22.85 41.75,21.66 JP1.2
XTAL3
  Top 0.305: U1.16 27.24,31.66 27.61,32.04 28.29,32.04 Q1.1
  Top 0.406: Q1.1 C11.2

### Text on the board
Bottom: 1520
tPlace: RX | TX | VCC | GND | ML | MR | 0Rx | A0 | 1Tx | A1 | 2 | A2 | A0 | A1 | A2 | A3 | 11 | 7 | A5 | A4 | 3 | A3 | 4 | A4 | 5~ | A5 | 6~ | 14 | BUZ / ON | 16 | 7 | http://escornabot.com | 8 | 15 | 3V3 - 5V | 9~ | gnd | 10~ | 5V | 3V3 | 11~ | 12 | IO13 | Res | Cervus 1.0 | LRx/17 | 13~ | LTx/24 | GND | Reset | +V
bPlace: ML | MR | Tx | GND | VCC | Rx | 0Rx | A0 | 1Tx | A1 | A0 | A1 | A2 | A3 | 11 | 7 | A5 | A4 | 2 | A2 | 3 | A3 | 4 | A4 | (BUZ)5~ | A5 | 6~ | 14 | 7~ | 16 | 8 | 15 | 9~ | G | 10~ | 5V | 11~ | 3V3 | (KEY)12 | RESET | http://escornabot.com | 13~ | +Vin | 17 | GND | 24 | XDeSIG